# Altium schematic sheet DC_DC_5V_1.SchDoc
size Tabloid; DocumentNumber: 3; SheetNumber: 3; SheetTotal: 7; Sheet_Name: 5V page 1
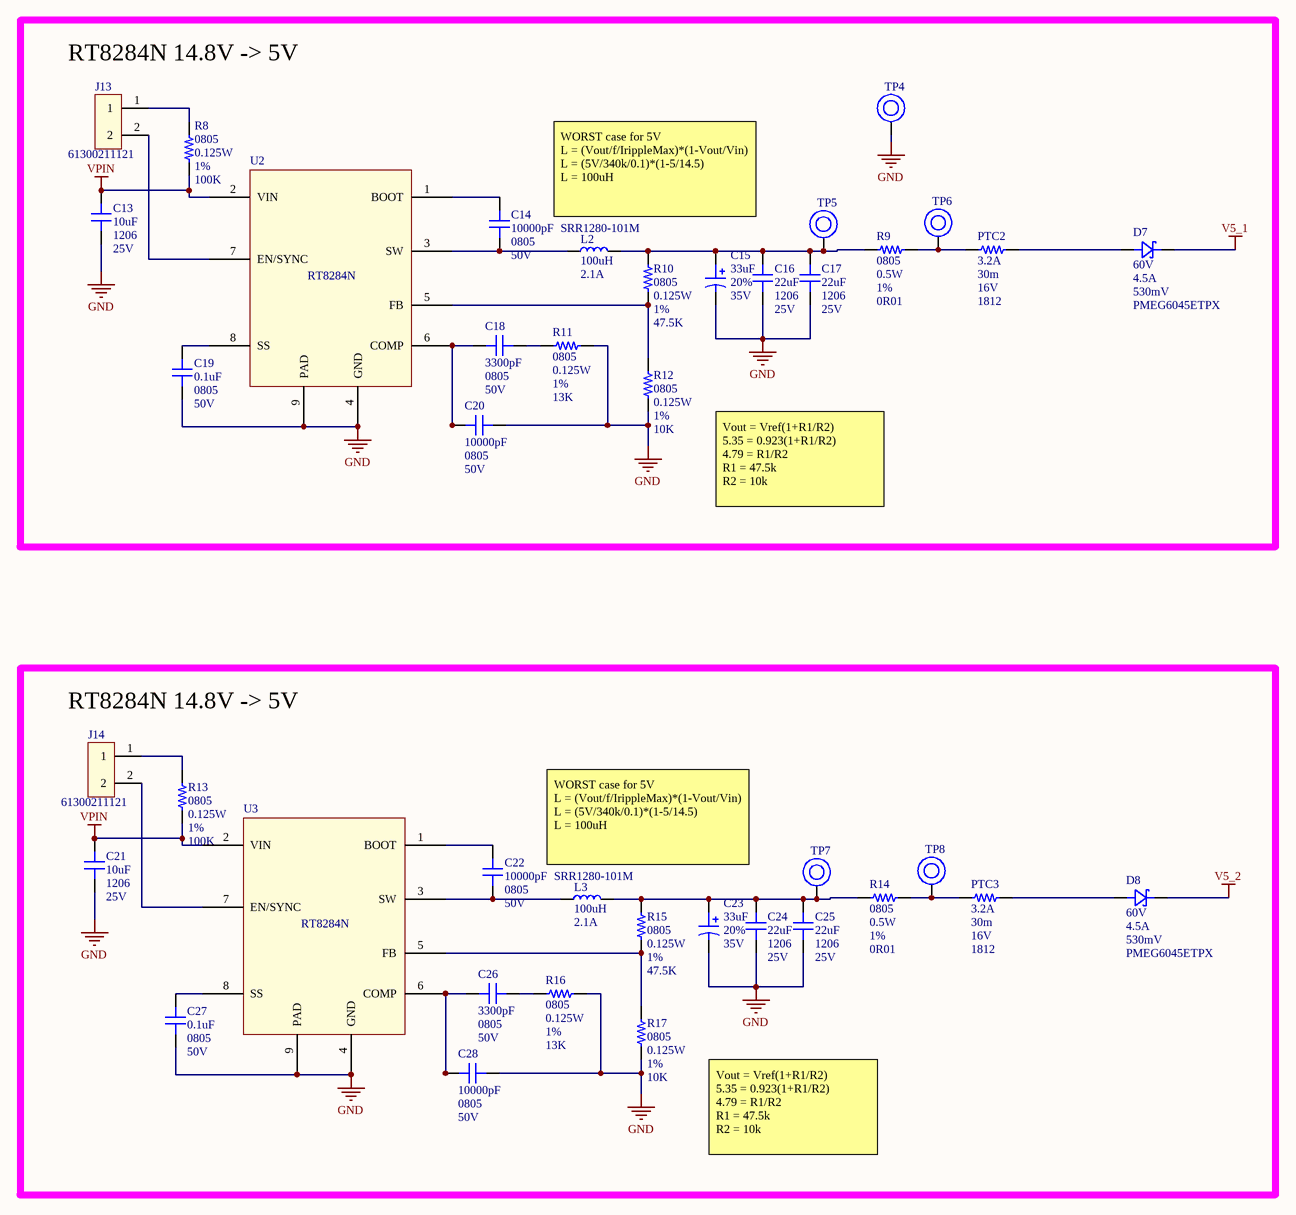
[diagram p0: DC_DC_5V_1.SchDoc]

## Parts
C13  value 10uF  Package: 1206  Voltage: 25V  [CAP_1206]  (hidden comment: CAP_‎CL31A106KAHNFNE‎)
C14  value 10000pF  Package: 0805  Voltage: 50V  [CAP_0805]  (hidden comment: CAP_‎‎‎‎CL21B103KBANNNC)
C15  value 33uF  Tolerance: 20%  Voltage: 35V  [CAP ALU - 6.3mm DIA]  (hidden comment: CAP_EEE-FK1V330P)
C16  value 22uF  Package: 1206  Voltage: 25V  [CAP_1206]  (hidden comment: CAP_‎‎CL31A226KAHNNNE‎)
C17  value 22uF  Package: 1206  Voltage: 25V  [CAP_1206]  (hidden comment: CAP_‎‎CL31A226KAHNNNE‎)
C18  value 3300pF  Package: 0805  Voltage: 50V  [CAP_0805]  (hidden comment: CAP_CL21B332KBANNNC‎)
C19  value 0.1uF  Package: 0805  Voltage: 50V  [CAP_0805]  (hidden comment: CAP_CC0805KRX7R9BB104‎)
C20  value 10000pF  Package: 0805  Voltage: 50V  [CAP_0805]  (hidden comment: CAP_‎‎‎‎CL21B103KBANNNC)
C21  value 10uF  Package: 1206  Voltage: 25V  [CAP_1206]  (hidden comment: CAP_‎CL31A106KAHNFNE‎)
C22  value 10000pF  Package: 0805  Voltage: 50V  [CAP_0805]  (hidden comment: CAP_‎‎‎‎CL21B103KBANNNC)
C23  value 33uF  Tolerance: 20%  Voltage: 35V  [CAP ALU - 6.3mm DIA]  (hidden comment: CAP_EEE-FK1V330P)
C24  value 22uF  Package: 1206  Voltage: 25V  [CAP_1206]  (hidden comment: CAP_‎‎CL31A226KAHNNNE‎)
C25  value 22uF  Package: 1206  Voltage: 25V  [CAP_1206]  (hidden comment: CAP_‎‎CL31A226KAHNNNE‎)
C26  value 3300pF  Package: 0805  Voltage: 50V  [CAP_0805]  (hidden comment: CAP_CL21B332KBANNNC‎)
C27  value 0.1uF  Package: 0805  Voltage: 50V  [CAP_0805]  (hidden comment: CAP_CC0805KRX7R9BB104‎)
C28  value 10000pF  Package: 0805  Voltage: 50V  [CAP_0805]  (hidden comment: CAP_‎‎‎‎CL21B103KBANNNC)
D7  Voltage: 60V  Current: 4.5A  Vf: 530mV  Part number: PMEG6045ETPX  [DO-214AC_SOD128]  (hidden comment: DIODE_SCH_PMEG6045ETPX)
D8  Voltage: 60V  Current: 4.5A  Vf: 530mV  Part number: PMEG6045ETPX  [DO-214AC_SOD128]  (hidden comment: DIODE_SCH_PMEG6045ETPX)
J13  Part number: 61300211121  [HDR1X2]  (hidden comment: Header 2 pin SM)
J14  Part number: 61300211121  [HDR1X2]  (hidden comment: Header 2 pin SM)
L2  value 100uH  Current: 2.1A  Part number: SRR1280-101M  [BOURNS 12.5x12.5mm]  (hidden comment: IND_SRR1280-101M)
L3  value 100uH  Current: 2.1A  Part number: SRR1280-101M  [BOURNS 12.5x12.5mm]  (hidden comment: IND_SRR1280-101M)
PTC2  Trip value: 3.2A  Res: 30m  Voltage: 16V  Package: 1812  [PTC - 1812]  (hidden comment: PTC_0ZCG0160BF2C)
PTC3  Trip value: 3.2A  Res: 30m  Voltage: 16V  Package: 1812  [PTC - 1812]  (hidden comment: PTC_0ZCG0160BF2C)
R8  value 100K  Package: 0805  Power: 0.125W  Tolerance: 1%  [RES_0805]  (hidden comment: RES_‎RMCF0805FT100K‎)
R9  value 0R01  Package: 0805  Power: 0.5W  Tolerance: 1%  [RES_0805]  (hidden comment: RES_‎‎‎‎‎ KRL1220E-M-R010-F-T5)
R10  value 47.5K  Package: 0805  Power: 0.125W  Tolerance: 1%  [RES_0805]  (hidden comment: RES_‎‎RMCF0805FT47K5‎)
R11  value 13K  Package: 0805  Power: 0.125W  Tolerance: 1%  [RES_0805]  (hidden comment: RES_‎ RC0805FR-0713KL)
R12  value 10K  Package: 0805  Power: 0.125W  Tolerance: 1%  [RES_0805]  (hidden comment: RES_‎RMCF0805FT10K0)
R13  value 100K  Package: 0805  Power: 0.125W  Tolerance: 1%  [RES_0805]  (hidden comment: RES_‎RMCF0805FT100K‎)
R14  value 0R01  Package: 0805  Power: 0.5W  Tolerance: 1%  [RES_0805]  (hidden comment: RES_‎‎‎‎‎ KRL1220E-M-R010-F-T5)
R15  value 47.5K  Package: 0805  Power: 0.125W  Tolerance: 1%  [RES_0805]  (hidden comment: RES_‎‎RMCF0805FT47K5‎)
R16  value 13K  Package: 0805  Power: 0.125W  Tolerance: 1%  [RES_0805]  (hidden comment: RES_‎ RC0805FR-0713KL)
R17  value 10K  Package: 0805  Power: 0.125W  Tolerance: 1%  [RES_0805]  (hidden comment: RES_‎RMCF0805FT10K0)
TP4  TestPoint 3x3mm  [TestPoint 3X3mm]  (value not drawn)
TP5  TestPoint 3x3mm  [TestPoint 3X3mm]  (value not drawn)
TP6  TestPoint 3x3mm  [TestPoint 3X3mm]  (value not drawn)
TP7  TestPoint 3x3mm  [TestPoint 3X3mm]  (value not drawn)
TP8  TestPoint 3x3mm  [TestPoint 3X3mm]  (value not drawn)
U2  REG_SW_RT8284N  [SOP8]  (value not drawn)
U3  REG_SW_RT8284N  [SOP8]  (value not drawn)

## Blocks framed on the sheet
RT8284N 14.8V -> 5V: C13-C20 D7 J13 L2 PTC2 R8-R12 TP4-TP6 U2
RT8284N 14.8V -> 5V: C21-C28 D8 J14 L3 PTC3 R13-R17 TP7 TP8 U3

## Nets
GND: C13.2 C15.2 C16.2 C17.2 C19.2 C20.2 C21.2 C23.2 C24.2 C25.2 C27.2 C28.2 R11.1 R12.2 R16.2 R17.2 TP4.1 U2.4(GND) U2.9(PAD) U3.4(GND) U3.9(PAD)
V5_1: D7.2
V5_2: D8.2
VPIN: C13.1 C21.1 R8.2 R13.1 U2.2(VIN) U3.2(VIN)
NetC14_1: C14.1 U2.1(BOOT)
NetC14_2: C14.2 L2.1 U2.3(SW)
NetC15_1: C15.1 C16.1 C17.1 L2.2 R9.1 R10.1 TP5.1
NetC18_1: C18.1 C20.1 U2.6(COMP)
NetC18_2: C18.2 R11.2
NetC19_1: C19.1 U2.8(SS)
NetC22_1: C22.1 U3.1(BOOT)
NetC22_2: C22.2 L3.1 U3.3(SW)
NetC23_1: C23.1 C24.1 C25.1 L3.2 R14.1 R15.1 TP7.1
NetC26_1: C26.1 C28.1 U3.6(COMP)
NetC26_2: C26.2 R16.1
NetC27_1: C27.1 U3.8(SS)
NetD7_1: D7.1 PTC2.2
NetD8_1: D8.1 PTC3.2
NetJ13_1: J13.1 R8.1
NetJ13_2: J13.2 U2.7(EN/SYNC)
NetJ14_1: J14.1 R13.2
NetJ14_2: J14.2 U3.7(EN/SYNC)
NetPTC2_1: PTC2.1 R9.2 TP6.1
NetPTC3_1: PTC3.1 R14.2 TP8.1
NetR10_2: R10.2 R12.1 U2.5(FB)
NetR15_2: R15.2 R17.1 U3.5(FB)

## Notes on the sheet
- WORST case for 5V
  L = (Vout/f/IrippleMax)*(1-Vout/Vin)
  L = (5V/340k/0.1)*(1-5/14.5)
  L = 100uH
- Vout = Vref(1+R1/R2)
  5.35 = 0.923(1+R1/R2)
  4.79 = R1/R2
  R1 = 47.5k
  R2 = 10k
- Sheet Name
- Project Title
- Global Project
- Size
- Group
- Revision
- Date
- Sheet
- of
- Filename
- Designers

## Library data of the parts
C13 C21 = CAP_‎CL31A106KAHNFNE‎: CAP CER 10uF 25V 1206; Part number: CL31A106KAHNFNE‎
C14 C20 C22 C28 = CAP_‎‎‎‎CL21B103KBANNNC: CAP CER 10000pF 50V 0805; Part number: ‎CL21B103KBANNNC
C15 C23 = CAP_EEE-FK1V330P: CAP ALU 33µF 35V; Part number: EEE-FK1V330P; Package: 6.30mm
C16 C17 C24 C25 = CAP_‎‎CL31A226KAHNNNE‎: CAP CER 22uF 25V 1206; Part number: CL31A226KAHNNNE‎
C18 C26 = CAP_CL21B332KBANNNC‎: CAP CER 3300pF 50V 0805; Part number: CL21B332KBANNNC‎
C19 C27 = CAP_CC0805KRX7R9BB104‎: CAP CER 0.1uF 50V 0805; Part number: CC0805KRX7R9BB104‎
D7 D8 = DIODE_SCH_PMEG6045ETPX: Diode Schottky 60V 4.5A Surface Mount CFP5; Package: SOD-128
L2 L3 = IND_SRR1280-101M: IND 100µH Shielded Wirewound Inductor 2.1A; Tolerance: 20%; Package: Nonstandard
PTC2 PTC3 = PTC_0ZCG0160BF2C: PTC_Polymeric PTC Resettable Fuse 16V 1.6A Ih; Part number: 0ZCG0160BF2C
R8 R13 = RES_‎RMCF0805FT100K‎: RES 100K 1% 1/8W 0805; Part number: ‎RMCF0805FT100K‎
R9 R14 = RES_‎‎‎‎‎ KRL1220E-M-R010-F-T5: RES 0.01R 1% 1/2W 0805; Part number: KRL1220E-M-R010-F-T5
R10 R15 = RES_‎‎RMCF0805FT47K5‎: RES 47.5K 1% 1/8W 0805; Part number: RMCF0805FT47K5‎
R11 R16 = RES_‎ RC0805FR-0713KL: RES 13K 1% 1/8W 0805; Part number: RC0805FR-0713KL
R12 R17 = RES_‎RMCF0805FT10K0: RES 10K 1% 1/8W 0805; Part number: RMCF0805FT10K0
U2 U3 = REG_SW_RT8284N: REG 2A, 23V, 340kHz Synchronous Step-Down Converter; Part number: RT8284N